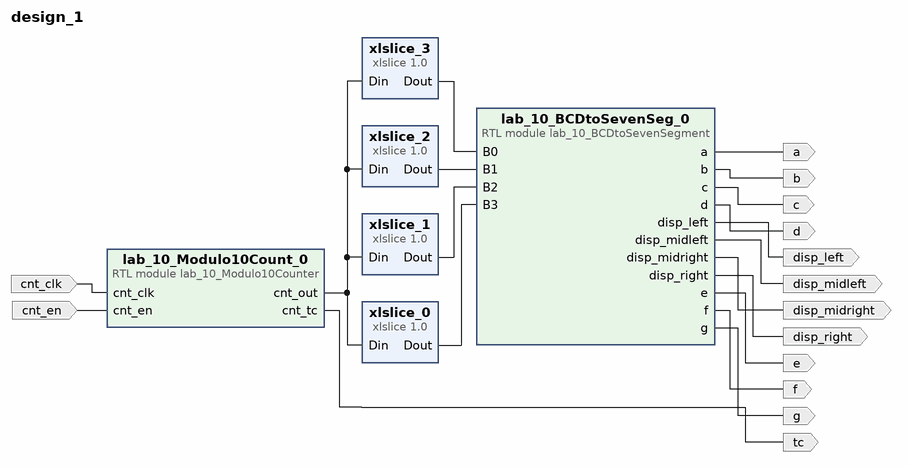
[diagram p0: block diagram of the top level]
# Vivado block design design_1, xc7a35tcpg236-1, Vivado 2023.2
create_bd_design design_1

create_bd_port -dir O a
create_bd_port -dir O b
create_bd_port -dir O c
create_bd_port -dir O d
create_bd_port -dir O e
create_bd_port -dir O f
create_bd_port -dir O g
create_bd_port -dir O disp_right
create_bd_port -dir O disp_left
create_bd_port -dir O disp_midright
create_bd_port -dir O disp_midleft
create_bd_port -dir I -type clk cnt_clk
create_bd_port -dir I cnt_en
create_bd_port -dir O tc

create_bd_cell -type module -reference lab_10_Modulo10Counter lab_10_Modulo10Count_0
create_bd_cell -type module -reference lab_10_BCDtoSevenSegment lab_10_BCDtoSevenSeg_0
create_bd_cell -type ip -vlnv xilinx.com:ip:xlslice:1.0 xlslice_0
set_property -dict {CONFIG.DIN_FROM 3 CONFIG.DIN_TO 3 CONFIG.DIN_WIDTH 4} [get_bd_cells xlslice_0]
create_bd_cell -type ip -vlnv xilinx.com:ip:xlslice:1.0 xlslice_1
set_property -dict {CONFIG.DIN_FROM 2 CONFIG.DIN_TO 2 CONFIG.DIN_WIDTH 4} [get_bd_cells xlslice_1]
create_bd_cell -type ip -vlnv xilinx.com:ip:xlslice:1.0 xlslice_2
set_property -dict {CONFIG.DIN_FROM 1 CONFIG.DIN_TO 1 CONFIG.DIN_WIDTH 4} [get_bd_cells xlslice_2]
create_bd_cell -type ip -vlnv xilinx.com:ip:xlslice:1.0 xlslice_3
set_property -dict {CONFIG.DIN_WIDTH 4} [get_bd_cells xlslice_3]

# ---- connections ----

connect_bd_net -net cnt_clk_0_1 [get_bd_ports cnt_clk] [get_bd_pins lab_10_Modulo10Count_0/cnt_clk]
connect_bd_net -net cnt_en_0_1 [get_bd_ports cnt_en] [get_bd_pins lab_10_Modulo10Count_0/cnt_en]
connect_bd_net [get_bd_pins lab_10_BCDtoSevenSeg_0/a] [get_bd_ports a]
connect_bd_net [get_bd_pins lab_10_BCDtoSevenSeg_0/b] [get_bd_ports b]
connect_bd_net [get_bd_pins lab_10_BCDtoSevenSeg_0/c] [get_bd_ports c]
connect_bd_net [get_bd_pins lab_10_BCDtoSevenSeg_0/d] [get_bd_ports d]
connect_bd_net [get_bd_pins lab_10_BCDtoSevenSeg_0/disp_left] [get_bd_ports disp_left]
connect_bd_net [get_bd_pins lab_10_BCDtoSevenSeg_0/disp_midleft] [get_bd_ports disp_midleft]
connect_bd_net [get_bd_pins lab_10_BCDtoSevenSeg_0/disp_midright] [get_bd_ports disp_midright]
connect_bd_net [get_bd_pins lab_10_BCDtoSevenSeg_0/disp_right] [get_bd_ports disp_right]
connect_bd_net [get_bd_pins lab_10_BCDtoSevenSeg_0/e] [get_bd_ports e]
connect_bd_net [get_bd_pins lab_10_BCDtoSevenSeg_0/f] [get_bd_ports f]
connect_bd_net [get_bd_pins lab_10_BCDtoSevenSeg_0/g] [get_bd_ports g]
connect_bd_net [get_bd_pins lab_10_Modulo10Count_0/cnt_out] \
  [get_bd_pins xlslice_0/Din] [get_bd_pins xlslice_1/Din] [get_bd_pins xlslice_2/Din] [get_bd_pins xlslice_3/Din]
connect_bd_net [get_bd_pins lab_10_Modulo10Count_0/cnt_tc] [get_bd_ports tc]
connect_bd_net [get_bd_pins xlslice_0/Dout] [get_bd_pins lab_10_BCDtoSevenSeg_0/B3]
connect_bd_net [get_bd_pins xlslice_1/Dout] [get_bd_pins lab_10_BCDtoSevenSeg_0/B2]
connect_bd_net [get_bd_pins xlslice_2/Dout] [get_bd_pins lab_10_BCDtoSevenSeg_0/B1]
connect_bd_net [get_bd_pins xlslice_3/Dout] [get_bd_pins lab_10_BCDtoSevenSeg_0/B0]

validate_bd_design
save_bd_design
